# EAGLE schematic FilterBoard_+-8V_MAX (EAGLE 6.5.0)
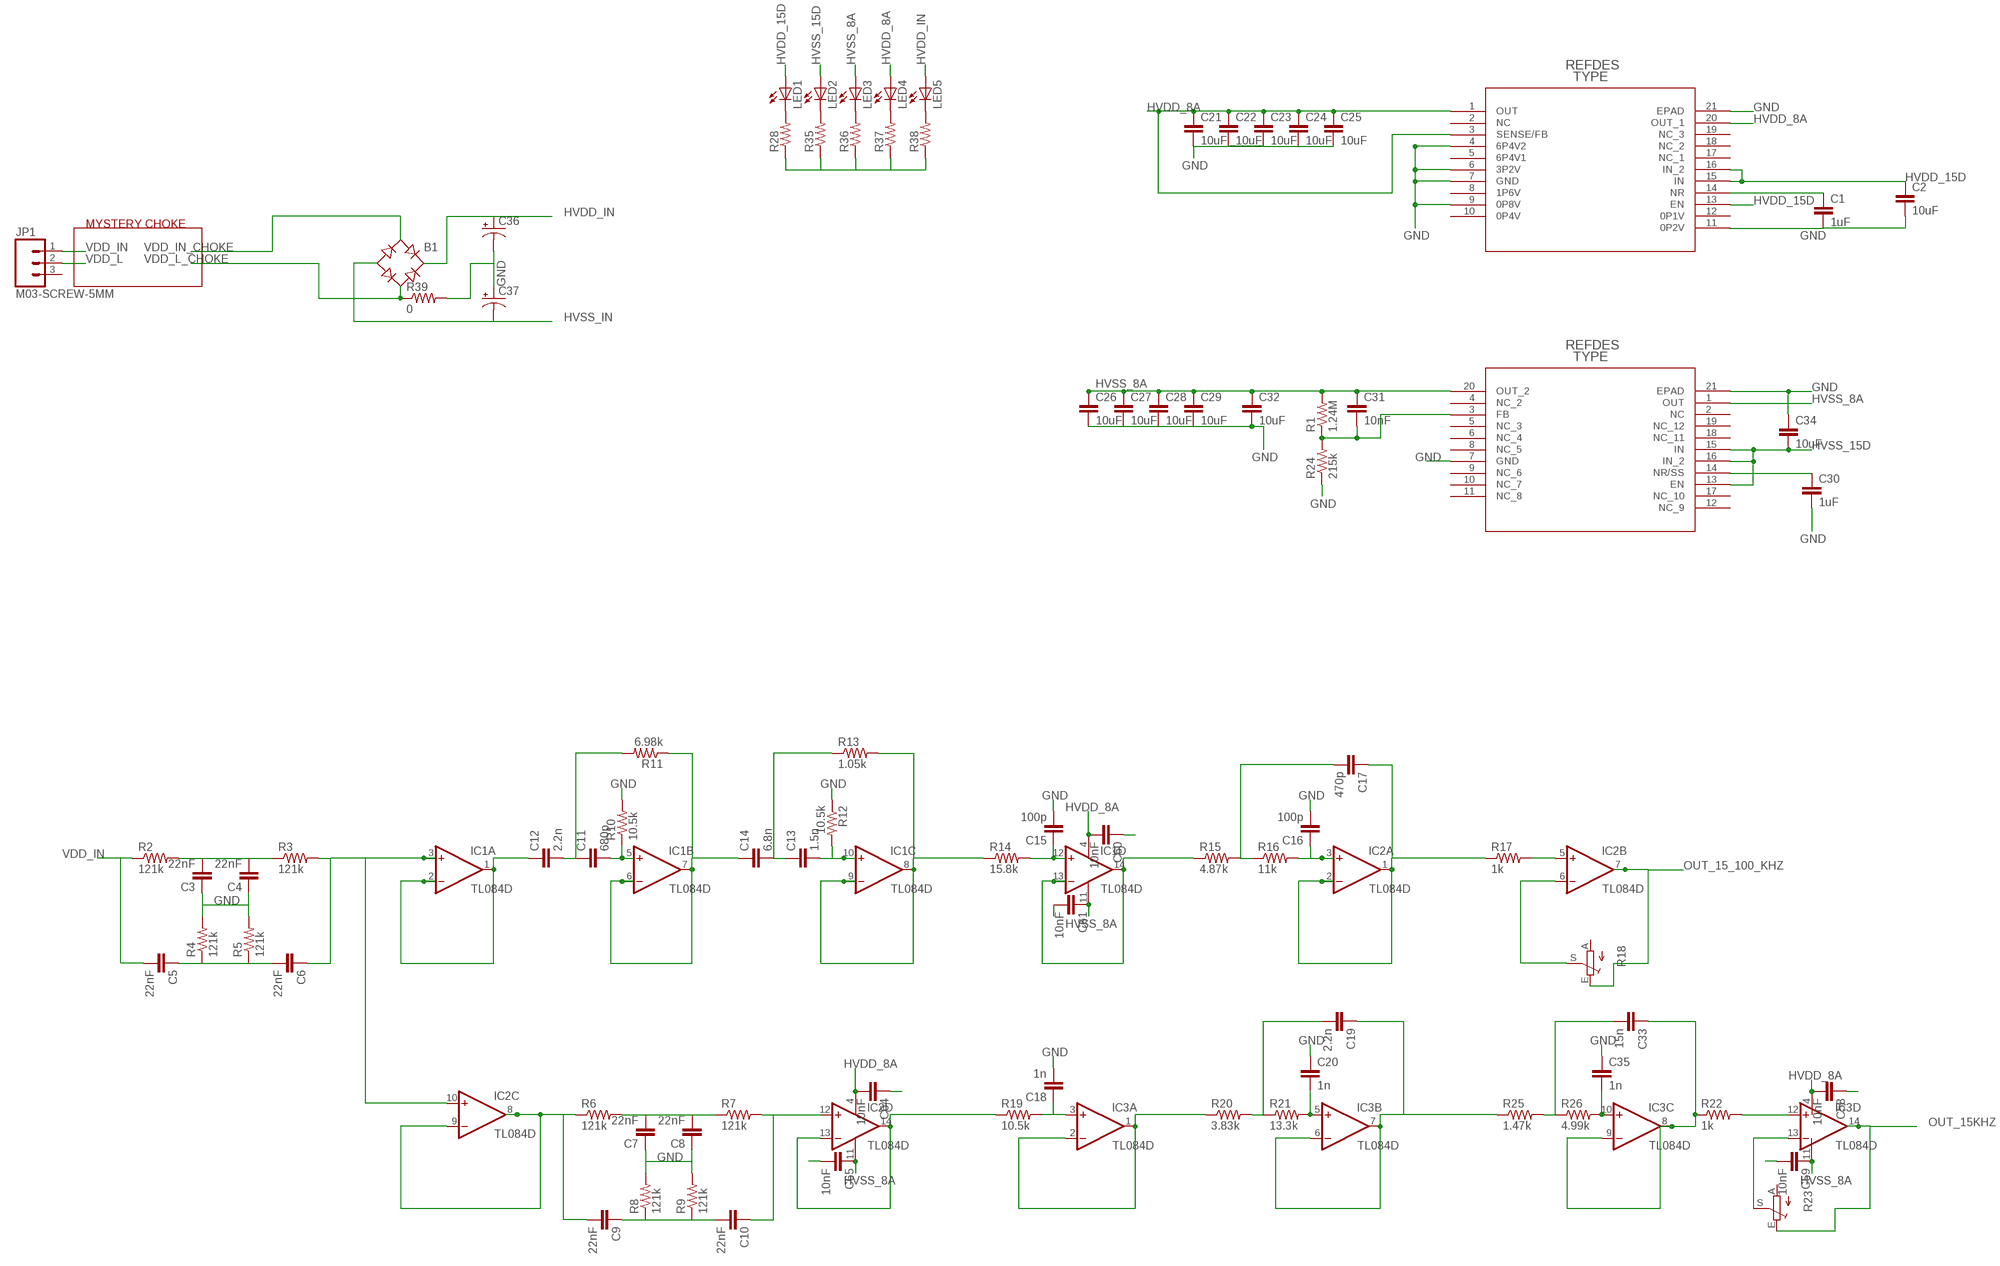
[diagram p0: schematic, sheet 1, part 1 of 2]
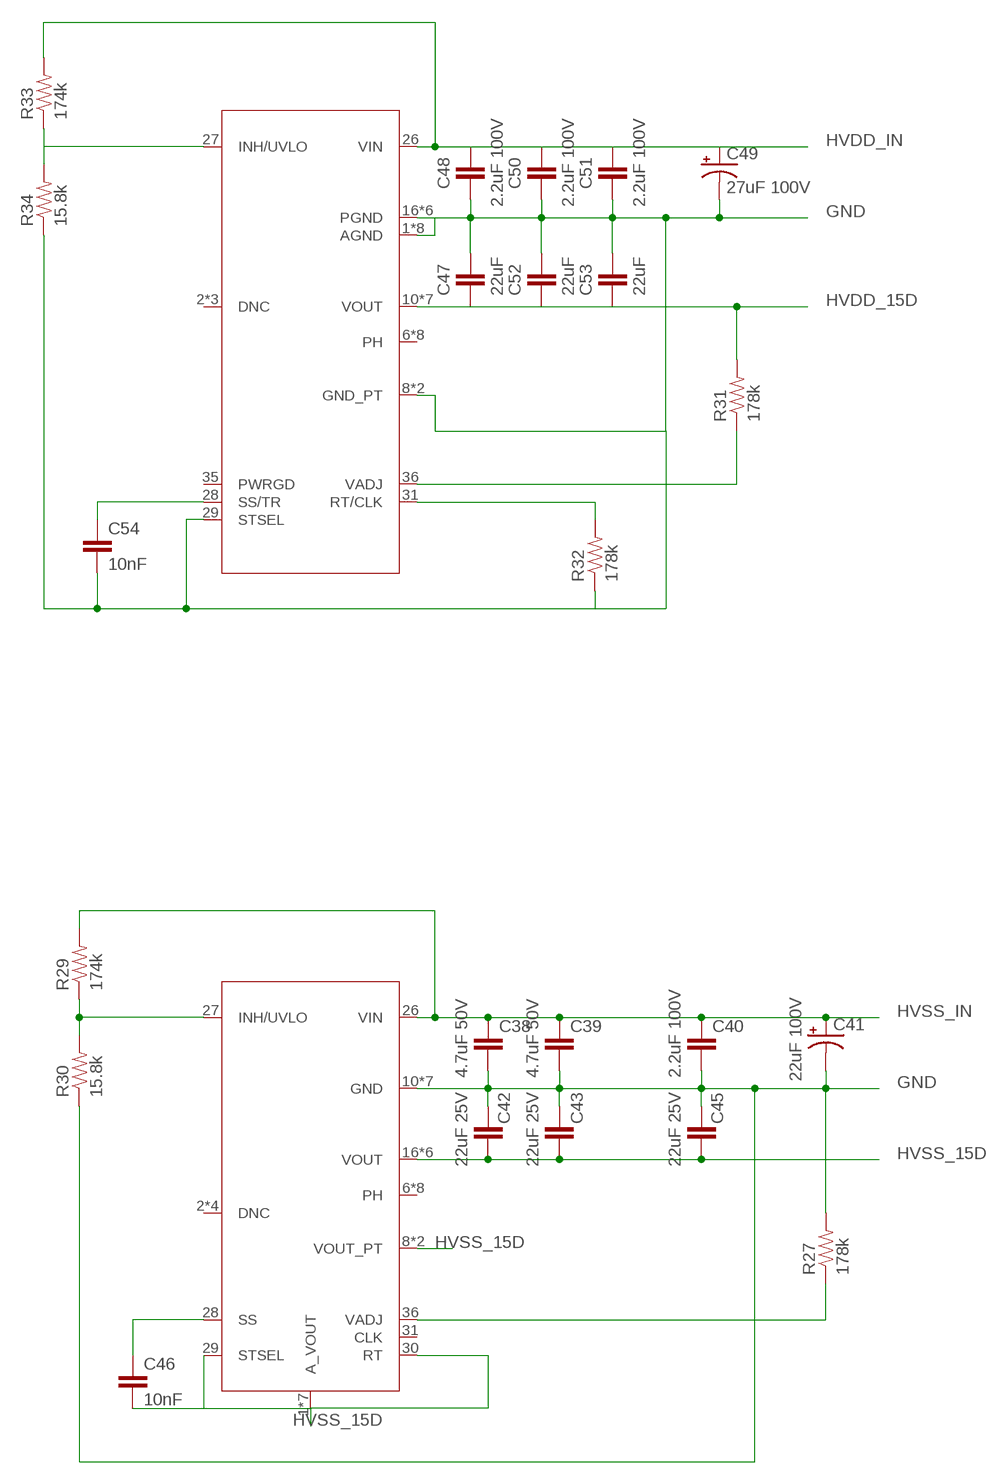
[diagram p1: schematic, sheet 1, part 2 of 2]

## Parts
B1  B-DIL  [B-DIL]
C1  1uF  CAP0805  [0805]
C2  10uF  CAP1206  [1206]
C3  22nF  CAP1206  [1206]
C4  22nF  CAP1206  [1206]
C5  22nF  CAP1206  [1206]
C6  22nF  CAP1206  [1206]
C7  22nF  CAP1206  [1206]
C8  22nF  CAP1206  [1206]
C9  22nF  CAP1206  [1206]
C10  22nF  CAP1206  [1206]
C11  680p  CAP1206  [1206]
C12  2.2n  CAP1206  [1206]
C13  1.5n  CAP1206  [1206]
C14  6.8n  CAP1206  [1206]
C15  100p  CAP1206  [1206]
C16  100p  CAP1206  [1206]
C17  470p  CAP1206  [1206]
C18  1n  CAP1206  [1206]
C19  2.2n  CAP1206  [1206]
C20  1n  CAP1206  [1206]
C21  10uF  CAP0805  [0805]
C22  10uF  CAP0805  [0805]
C23  10uF  CAP0805  [0805]
C24  10uF  CAP0805  [0805]
C25  10uF  CAP0805  [0805]
C26  10uF  CAP0805  [0805]
C27  10uF  CAP0805  [0805]
C28  10uF  CAP0805  [0805]
C29  10uF  CAP0805  [0805]
C30  1uF  CAP0805  [0805]
C31  10nF  CAP0805  [0805]
C32  10uF  CAP0805  [0805]
C33  15n  CAP1206  [1206]
C34  10uF  CAP1206  [1206]
C35  1n  CAP1206  [1206]
C36  CAP_POLPTH3  [CPOL-RADIAL-1000UF-63V]
C37  CAP_POLPTH3  [CPOL-RADIAL-1000UF-63V]
C38  4.7uF 50V  CAP1210  [1210]
C39  4.7uF 50V  CAP1210  [1210]
C40  2.2uF 100V  CAP1210  [1210]
C41  22uF 100V  CAP_POLPTH1  [CPOL-RADIAL-100UF-25V]
C42  22uF 25V  CAP1210  [1210]
C43  22uF 25V  CAP1210  [1210]
C45  22uF 25V  CAP1210  [1210]
C46  10nF  CAP0805  [0805]
C47  22uF  CAP1210  [1210]
C48  2.2uF 100V  CAP1210  [1210]
C49  27uF 100V  CAP_POLPTH1  [CPOL-RADIAL-100UF-25V]
C50  2.2uF 100V  CAP1210  [1210]
C51  2.2uF 100V  CAP1210  [1210]
C52  22uF  CAP1210  [1210]
C53  22uF  CAP1210  [1210]
C54  10nF  CAP0805  [0805]
C58  10nF  CAP0805  [0805]
C59  10nF  CAP0805  [0805]
C60  10nF  CAP0805  [0805]
C61  10nF  CAP0805  [0805]
C64  10nF  CAP0805  [0805]
C65  10nF  CAP0805  [0805]
IC1  TL084D  [SO14]
IC2  TL084D  [SO14]
IC3  TL084D  [SO14]
JP1  M03-SCREW-5MM  [SCREWTERMINAL-5MM-3]
LED1  LED1206  [LED-1206]
LED2  LED1206  [LED-1206]
LED3  LED1206  [LED-1206]
LED4  LED1206  [LED-1206]
LED5  LED1206  [LED-1206]
R1  1.24M  RESISTOR0805-RES  [0805]
R2  121k  RESISTOR0805-RES  [0805]
R3  121k  RESISTOR0805-RES  [0805]
R4  121k  RESISTOR0805-RES  [0805]
R5  121k  RESISTOR0805-RES  [0805]
R6  121k  RESISTOR0805-RES  [0805]
R7  121k  RESISTOR0805-RES  [0805]
R8  121k  RESISTOR0805-RES  [0805]
R9  121k  RESISTOR0805-RES  [0805]
R10  10.5k  RESISTOR0805-RES  [0805]
R11  6.98k  RESISTOR0805-RES  [0805]
R12  10.5k  RESISTOR0805-RES  [0805]
R13  1.05k  RESISTOR0805-RES  [0805]
R14  15.8k  RESISTOR0805-RES  [0805]
R15  4.87k  RESISTOR0805-RES  [0805]
R16  11k  RESISTOR0805-RES  [0805]
R17  1k  RESISTOR0805-RES  [0805]
R18  TRIM_EU-B90P  [SP19L]
R19  10.5k  RESISTOR0805-RES  [0805]
R20  3.83k  RESISTOR0805-RES  [0805]
R21  13.3k  RESISTOR0805-RES  [0805]
R22  1k  RESISTOR0805-RES  [0805]
R23  TRIM_EU-B90P  [SP19L]
R24  215k  RESISTOR0805-RES  [0805]
R25  1.47k  RESISTOR0805-RES  [0805]
R26  4.99k  RESISTOR0805-RES  [0805]
R27  178k  RESISTOR0805-RES  [0805]
R28  RESISTOR0805-RES  [0805]
R29  174k  RESISTOR0805-RES  [0805]
R30  15.8k  RESISTOR0805-RES  [0805]
R31  178k  RESISTOR0805-RES  [0805]
R32  178k  RESISTOR0805-RES  [0805]
R33  174k  RESISTOR0805-RES  [0805]
R34  15.8k  RESISTOR0805-RES  [0805]
R35  RESISTOR0805-RES  [0805]
R36  RESISTOR0805-RES  [0805]
R37  RESISTOR0805-RES  [0805]
R38  RESISTOR0805-RES  [0805]
R39  0  RESISTOR1206  [1206]
U7  TPS7A3301_RGW_20  [RGW20_3P15X3P15]
U8  TPS84250_RKG_41  [RKG41]
U$1  TPS84259_RKG_41  [RKG41]
U$2  TPS7A4700_RGW_20  [RGW20_3P15X3P15]

## Nets
GND: C1.2 C2.2 C3.1 C4.1 C7.1 C8.1 C15.2 C16.2 C18.2 C20.1 C21.2 C22.2 C23.2 C24.2 C25.2 C26.2 C27.2 C28.2 C29.2 C30.2 C32.2 C34.1 C35.1 C36.2(-) C37.1(+) C38.2 C39.2 C40.2 C41.2(-) C42.1 C43.1 C45.1 C47.1 C48.2 C49.2(-) C50.2 C51.2 C52.1 C53.1 C54.2 C58.1 C59.2 C60.1 C61.2 C64.1 C65.2 R4.2 R5.2 R8.2 R9.2 R10.2 R12.1 R24.1 R27.2 R28.1 R30.1 R32.1 R34.1 R35.1 R36.1 R37.1 R38.1 R39.2 U7.7(GND) U7.21(EPAD) U8.1(AGND) U8.4(AGND) U8.5(AGND) U8.8(GND_PT) U8.9(GND_PT) U8.16(PGND) U8.17(PGND) U8.18(PGND) U8.19(PGND) U8.20(PGND) U8.29(STSEL) U8.30(AGND) U8.32(AGND) U8.33(AGND) U8.34(AGND) U8.37(AGND) U8.40(PGND) U$1.10(GND) U$1.11(GND) U$1.12(GND) U$1.13(GND) U$1.14(GND) U$1.15(GND) U$1.39(GND) U$2.4(6P4V2) U$2.6(3P2V) U$2.7(GND) U$2.9(0P8V) U$2.11(0P2V) U$2.21(EPAD)
HVDD_8A: C21.1 C22.1 C23.1 C24.1 C25.1 C58.2 C60.2 C64.2 IC1.4(P:V+) IC2.4(P:V+) IC3.4(P:V+) LED4.A U$2.1(OUT) U$2.3(SENSE/FB) U$2.20(OUT_1)
HVDD_15D: C2.1 C47.2 C52.2 C53.2 LED1.A R31.2 U8.10(VOUT) U8.11(VOUT) U8.12(VOUT) U8.13(VOUT) U8.14(VOUT) U8.15(VOUT) U8.39(VOUT) U$2.13(EN) U$2.15(IN) U$2.16(IN_2)
HVDD_IN: B1.+ C36.1(+) C48.1 C49.1(+) C50.1 C51.1 LED5.A R33.2 U8.26(VIN)
HVSS_8A: C26.1 C27.1 C28.1 C29.1 C31.1 C32.1 C59.1 C61.1 C65.1 IC1.11(P:V-) IC2.11(P:V-) IC3.11(P:V-) LED3.A R1.2 U7.1(OUT) U7.20(OUT_2)
HVSS_15D: C34.2 C42.2 C43.2 C45.2 C46.2 LED2.A U7.13(EN) U7.15(IN) U7.16(IN_2) U$1.1(A_VOUT) U$1.4(A_VOUT) U$1.5(A_VOUT) U$1.8(VOUT_PT) U$1.9(VOUT_PT) U$1.16(VOUT) U$1.17(VOUT) U$1.18(VOUT) U$1.19(VOUT) U$1.20(VOUT) U$1.29(STSEL) U$1.30(RT) U$1.32(A_VOUT) U$1.33(A_VOUT) U$1.34(A_VOUT) U$1.37(A_VOUT) U$1.40(VOUT)
HVSS_IN: B1.- C37.2(-) C38.1 C39.1 C40.1 C41.1(+) R29.2 U$1.26(VIN)
N$1: C1.1 U$2.14(NR)
N$2: C3.2 C4.2 R2.2 R3.1
N$3: C9.2 IC2.8(C:OUT) IC2.9(C:-IN) R6.1
N$4: C33.1 IC3.8(C:OUT) IC3.9(C:-IN) R22.1
N$5: C5.1 C6.2 R4.1 R5.1
N$6: C7.2 C8.2 R6.2 R7.1
N$7: C6.1 IC1.3(A:+IN) IC2.10(C:+IN) R3.2
N$8: C31.2 R1.1 R24.2 U7.3(FB)
N$9: C9.1 C10.2 R8.1 R9.1
N$10: C10.1 IC2.12(D:+IN) R7.2
N$12: C12.1 IC1.1(A:OUT) IC1.2(A:-IN)
N$13: C11.1 C12.2 R11.2
N$14: C11.2 IC1.5(B:+IN) R10.1
N$15: C14.1 IC1.6(B:-IN) IC1.7(B:OUT) R11.1
N$16: IC1.8(C:OUT) IC1.9(C:-IN) R13.2 R14.1
N$17: IC1.13(D:-IN) IC1.14(D:OUT) R15.1
N$18: C17.1 IC2.1(A:OUT) IC2.2(A:-IN) R17.1
N$19: IC2.6(B:-IN) R18.S
N$20: C35.2 IC3.10(C:+IN) R26.2
N$21: IC3.12(D:+IN) R22.2
N$22: IC3.13(D:-IN) R23.S
N$23: C33.2 R25.2 R26.1
N$24: C19.1 IC3.6(B:-IN) IC3.7(B:OUT) R25.1
N$25: R27.1 U$1.36(VADJ)
N$26: C20.2 IC3.5(B:+IN) R21.2
N$27: C19.2 R20.2 R21.1
N$28: IC3.1(A:OUT) IC3.2(A:-IN) R20.1
N$29: C18.1 IC3.3(A:+IN) R19.2
N$30: LED1.C R28.2
N$31: IC2.13(D:-IN) IC2.14(D:OUT) R19.1
N$32: R29.1 R30.2 U$1.27(INH/UVLO)
N$33: C30.1 U7.14(NR/SS)
N$34: C46.1 U$1.28(SS)
N$35: C13.1 C14.2 R13.1
N$36: C13.2 IC1.10(C:+IN) R12.2
N$37: R31.1 U8.36(VADJ)
N$38: C15.1 IC1.12(D:+IN) R14.2
N$39: R32.2 U8.31(RT/CLK)
N$40: C17.2 R15.2 R16.1
N$41: C16.1 IC2.3(A:+IN) R16.2
N$42: IC2.5(B:+IN) R17.2
N$43: R33.1 R34.2 U8.27(INH/UVLO)
N$44: C54.1 U8.28(SS/TR)
N$45: LED2.C R35.2
N$46: LED3.C R36.2
N$47: LED4.C R37.2
N$48: LED5.C R38.2
OUT_15_100_KHZ: IC2.7(B:OUT) R18.E
OUT_15KHZ: IC3.14(D:OUT) R23.E
VDD_IN: C5.2 JP1.1 R2.1
VDD_IN_CHOKE: B1.AC1
VDD_L: JP1.2
VDD_L_CHOKE: B1.AC2 R39.1
Unconnected: JP1.3 R18.A R23.A U7.2(NC) U7.4(NC_2) U7.5(NC_3) U7.6(NC_4) U7.8(NC_5) U7.9(NC_6) U7.10(NC_7) U7.11(NC_8) U7.12(NC_9) U7.17(NC_10) U7.18(NC_11) U7.19(NC_12) U8.2(DNC) U8.3(DNC) U8.6(PH) U8.7(PH) U8.21(PH) U8.22(PH) U8.23(PH) U8.24(PH) U8.25(DNC) U8.35(PWRGD) U8.38(PH) U8.41(PH) U$1.2(DNC) U$1.3(DNC) U$1.6(PH) U$1.7(PH) U$1.21(PH) U$1.22(PH) U$1.23(PH) U$1.24(PH) U$1.25(DNC) U$1.31(CLK) U$1.35(DNC) U$1.38(PH) U$1.41(PH) U$2.2(NC) U$2.5(6P4V1) U$2.8(1P6V) U$2.10(0P4V) U$2.12(0P1V) U$2.17(NC_1) U$2.18(NC_2) U$2.19(NC_3)

## Notes on the sheet
- MYSTERY CHOKE

## Library data of the parts
B1 = rectifier:B-DIL: RECTIFIER
C1-C20 C30 C31 C33-C35 C38-C40 C42 C43 C45-C48 C50-C54 C58-C61 C64 C65 = SensorCape:CAP: Capacitor Standard 0603 ceramic capacitor, and 0.1" leaded capacitor.
C21-C29 C32 = ASL:CAP: Capacitor Standard 0603 ceramic capacitor, and 0.1" leaded capacitor.
C36 C37 C49 = SensorCape:CAP_POL: Capacitor Polarized These are standard SMD and PTH capacitors. Normally 10uF, 47uF, and 100uF in electrolytic and tantalum varieties. Always verify the external diameter of the through hole cap, it varies with capacity, voltage, and manufacturer. The EIA devices should be standard.
C41 = ASL:CAP_POL: Capacitor Polarized These are standard SMD and PTH capacitors. Normally 10uF, 47uF, and 100uF in electrolytic and tantalum varieties. Always verify the external diameter of the through hole cap, it varies with capacity, voltage, and manufacturer. The EIA devices should be standard.
IC1-IC3 = linear:TL084: OP AMP
JP1 = ASL:M03: Header 3 Standard 3-pin 0.1" header. Use with straight break away headers (SKU : PRT-00116), right angle break away headers (PRT-00553), swiss pins (PRT-00743), machine pins (PRT-00117), and female headers (PRT-00115). Molex polarized connector foot print use with SKU : PRT-08232 with associated crimp pins and housings.
LED1-LED5 = ASL:LED: LEDs Standard schematic elements and footprints for 5mm, 3mm, 1206, and 0603 sized LEDs. 5mm - Spark Fun Electronics SKU : COM-00529 (and others)
R1 R24 R27-R39 = ASL:RESISTOR: Resistor Basic schematic elements and footprints for 0603, 1206, and PTH resistors.
R2-R17 R19-R22 R25 R26 = SensorCape:RESISTOR: Resistor Basic schematic elements and footprints for 0603, 1206, and PTH resistors.
R18 R23 = pot:TRIM_EU-: POTENTIOMETER
U7 = SensorCape:TPS7A3301_RGW_20
U8 = SensorCape:TPS84250_RKG_41
U$1 = SensorCape:TPS84259_RKG_41
U$2 = SensorCape:TPS7A4700_RGW_20